# Altium schematic sheet SoM-Interfaces.SchDoc
size A3; DocumentNumber: 1; SheetNumber: 1; SheetTotal: 10; PageSetup: Record=PageOptions|CenterHorizontal=True|CenterVertical=True|PrintScale=0.97|XCorrection=1.00|YCorrection=1.00|PrintKind=1|BorderSize=5000000|LeftOffset=0|BottomOffset=0|Orientation=2|PaperLength=2970|PaperWidth=2100|Scale=100|PaperSource=7|PrintQuality=600|MediaType=1|DitherType=10|PaperKind=A4|PrintScaleMode=1
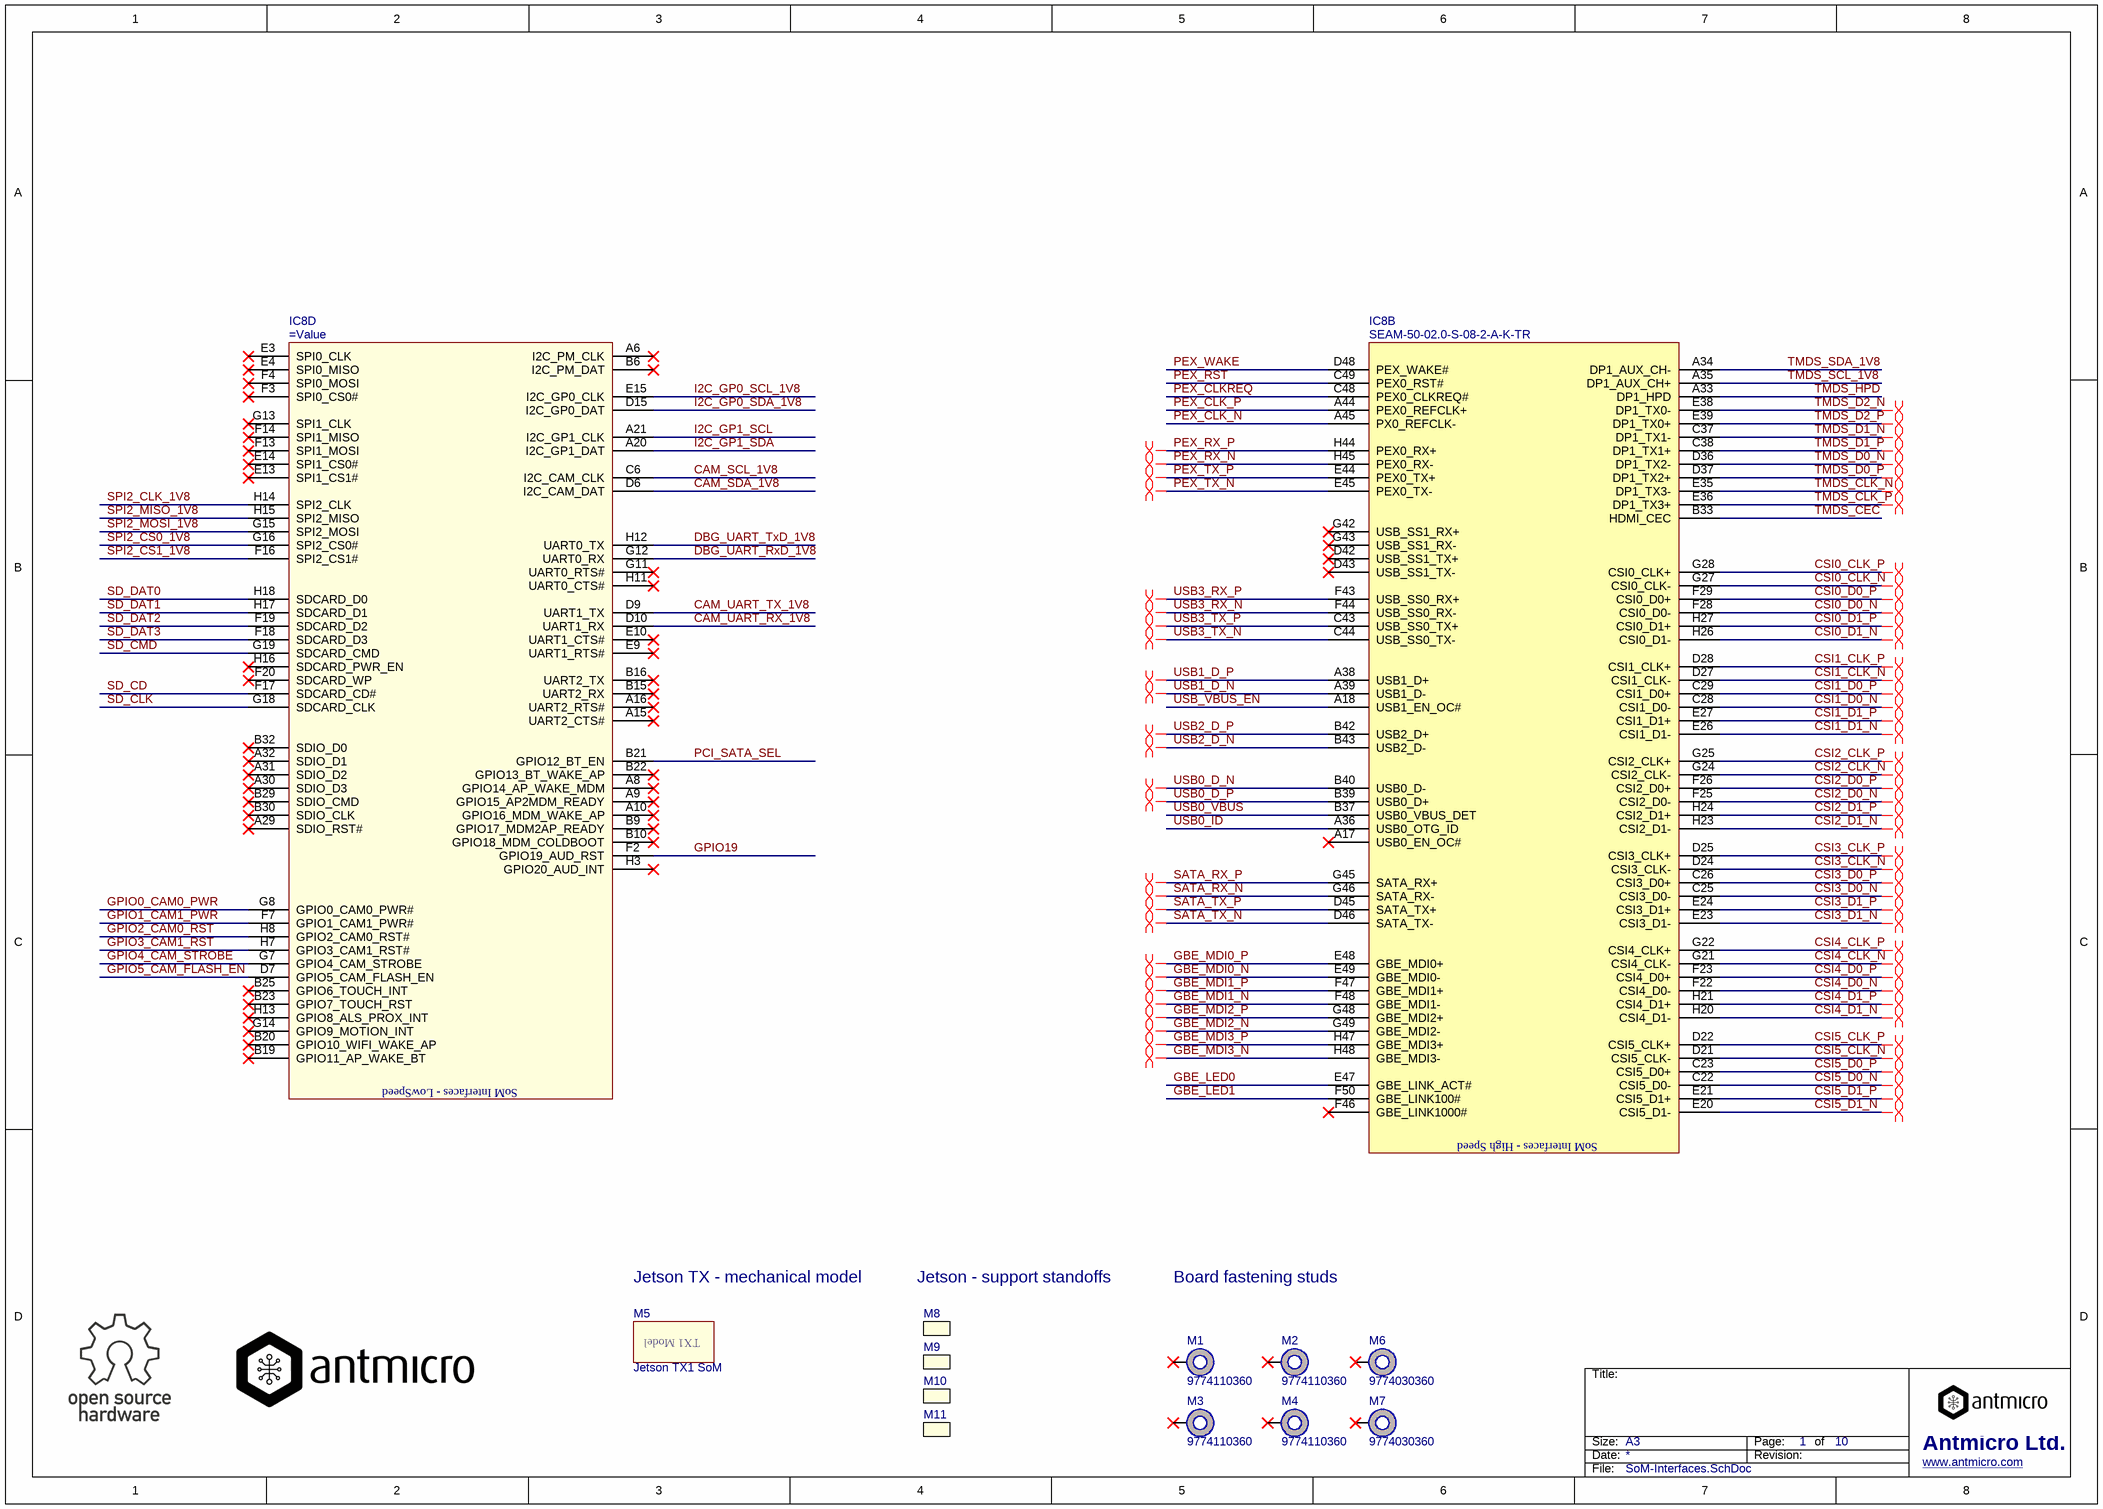
[diagram p0: SoM-Interfaces.SchDoc]

## Parts
IC8  SEAM-50-02.0-S-08-2-A-K-TR  [Nvidia-TX1-SoM]  (parts B,D of 4)
M1  9774110360  [WE_9774110360]
M2  9774110360  [WE_9774110360]
M3  9774110360  [WE_9774110360]
M4  9774110360  [WE_9774110360]
M5  Jetson TX1 SoM  [Nvidia-TX1-Model]
M6  9774030360  [M3-3mm]
M7  9774030360  [M3-3mm]
M8  GENERIC_BOM_ONLY  (value not drawn)  (mechanical)
M9  GENERIC_BOM_ONLY  (value not drawn)  (mechanical)
M10  GENERIC_BOM_ONLY  (value not drawn)  (mechanical)
M11  GENERIC_BOM_ONLY  (value not drawn)  (mechanical)

## Nets
CAM_SCL_1V8: IC8.C6(I2C_CAM_CLK)
CAM_SDA_1V8: IC8.D6(I2C_CAM_DAT)
CAM_UART_RX_1V8: IC8.D10(UART1_RX)
CAM_UART_TX_1V8: IC8.D9(UART1_TX)
CSI0_CLK_N: IC8.G27(CSI0_CLK-)
CSI0_CLK_P: IC8.G28(CSI0_CLK+)
CSI0_D0_N: IC8.F28(CSI0_D0-)
CSI0_D0_P: IC8.F29(CSI0_D0+)
CSI0_D1_N: IC8.H26(CSI0_D1-)
CSI0_D1_P: IC8.H27(CSI0_D1+)
CSI1_CLK_N: IC8.D27(CSI1_CLK-)
CSI1_CLK_P: IC8.D28(CSI1_CLK+)
CSI1_D0_N: IC8.C28(CSI1_D0-)
CSI1_D0_P: IC8.C29(CSI1_D0+)
CSI1_D1_N: IC8.E26(CSI1_D1-)
CSI1_D1_P: IC8.E27(CSI1_D1+)
CSI2_CLK_N: IC8.G24(CSI2_CLK-)
CSI2_CLK_P: IC8.G25(CSI2_CLK+)
CSI2_D0_N: IC8.F25(CSI2_D0-)
CSI2_D0_P: IC8.F26(CSI2_D0+)
CSI2_D1_N: IC8.H23(CSI2_D1-)
CSI2_D1_P: IC8.H24(CSI2_D1+)
CSI3_CLK_N: IC8.D24(CSI3_CLK-)
CSI3_CLK_P: IC8.D25(CSI3_CLK+)
CSI3_D0_N: IC8.C25(CSI3_D0-)
CSI3_D0_P: IC8.C26(CSI3_D0+)
CSI3_D1_N: IC8.E23(CSI3_D1-)
CSI3_D1_P: IC8.E24(CSI3_D1+)
CSI4_CLK_N: IC8.G21(CSI4_CLK-)
CSI4_CLK_P: IC8.G22(CSI4_CLK+)
CSI4_D0_N: IC8.F22(CSI4_D0-)
CSI4_D0_P: IC8.F23(CSI4_D0+)
CSI4_D1_N: IC8.H20(CSI4_D1-)
CSI4_D1_P: IC8.H21(CSI4_D1+)
CSI5_CLK_N: IC8.D21(CSI5_CLK-)
CSI5_CLK_P: IC8.D22(CSI5_CLK+)
CSI5_D0_N: IC8.C22(CSI5_D0-)
CSI5_D0_P: IC8.C23(CSI5_D0+)
CSI5_D1_N: IC8.E20(CSI5_D1-)
CSI5_D1_P: IC8.E21(CSI5_D1+)
DBG_UART_RxD_1V8: IC8.G12(UART0_RX)
DBG_UART_TxD_1V8: IC8.H12(UART0_TX)
GBE_LED0: IC8.E47(GBE_LINK_ACT#)
GBE_LED1: IC8.F50(GBE_LINK100#)
GBE_MDI0_N: IC8.E49(GBE_MDI0-)
GBE_MDI0_P: IC8.E48(GBE_MDI0+)
GBE_MDI1_N: IC8.F48(GBE_MDI1-)
GBE_MDI1_P: IC8.F47(GBE_MDI1+)
GBE_MDI2_N: IC8.G49(GBE_MDI2-)
GBE_MDI2_P: IC8.G48(GBE_MDI2+)
GBE_MDI3_N: IC8.H48(GBE_MDI3-)
GBE_MDI3_P: IC8.H47(GBE_MDI3+)
GPIO0_CAM0_PWR: IC8.G8(GPIO0_CAM0_PWR#)
GPIO1_CAM1_PWR: IC8.F7(GPIO1_CAM1_PWR#)
GPIO2_CAM0_RST: IC8.H8(GPIO2_CAM0_RST#)
GPIO3_CAM1_RST: IC8.H7(GPIO3_CAM1_RST#)
GPIO4_CAM_STROBE: IC8.G7(GPIO4_CAM_STROBE)
GPIO5_CAM_FLASH_EN: IC8.D7(GPIO5_CAM_FLASH_EN)
GPIO19: IC8.F2(GPIO19_AUD_RST)
I2C_GP0_SCL_1V8: IC8.E15(I2C_GP0_CLK)
I2C_GP0_SDA_1V8: IC8.D15(I2C_GP0_DAT)
I2C_GP1_SCL: IC8.A21(I2C_GP1_CLK)
I2C_GP1_SDA: IC8.A20(I2C_GP1_DAT)
PCI_SATA_SEL: IC8.B21(GPIO12_BT_EN)
PEX_CLK_N: IC8.A45(PX0_REFCLK-)
PEX_CLK_P: IC8.A44(PEX0_REFCLK+)
PEX_CLKREQ: IC8.C48(PEX0_CLKREQ#)
PEX_RST: IC8.C49(PEX0_RST#)
PEX_RX_N: IC8.H45(PEX0_RX-)
PEX_RX_P: IC8.H44(PEX0_RX+)
PEX_TX_N: IC8.E45(PEX0_TX-)
PEX_TX_P: IC8.E44(PEX0_TX+)
PEX_WAKE: IC8.D48(PEX_WAKE#)
SATA_RX_N: IC8.G46(SATA_RX-)
SATA_RX_P: IC8.G45(SATA_RX+)
SATA_TX_N: IC8.D46(SATA_TX-)
SATA_TX_P: IC8.D45(SATA_TX+)
SD_CD: IC8.F17(SDCARD_CD#)
SD_CLK: IC8.G18(SDCARD_CLK)
SD_CMD: IC8.G19(SDCARD_CMD)
SD_DAT0: IC8.H18(SDCARD_D0)
SD_DAT1: IC8.H17(SDCARD_D1)
SD_DAT2: IC8.F19(SDCARD_D2)
SD_DAT3: IC8.F18(SDCARD_D3)
SPI2_CLK_1V8: IC8.H14(SPI2_CLK)
SPI2_CS0_1V8: IC8.G16(SPI2_CS0#)
SPI2_CS1_1V8: IC8.F16(SPI2_CS1#)
SPI2_MISO_1V8: IC8.H15(SPI2_MISO)
SPI2_MOSI_1V8: IC8.G15(SPI2_MOSI)
TMDS_CEC: IC8.B33(HDMI_CEC)
TMDS_CLK_N: IC8.E35(DP1_TX3-)
TMDS_CLK_P: IC8.E36(DP1_TX3+)
TMDS_D0_N: IC8.D36(DP1_TX2-)
TMDS_D0_P: IC8.D37(DP1_TX2+)
TMDS_D1_N: IC8.C37(DP1_TX1-)
TMDS_D1_P: IC8.C38(DP1_TX1+)
TMDS_D2_N: IC8.E38(DP1_TX0-)
TMDS_D2_P: IC8.E39(DP1_TX0+)
TMDS_HPD: IC8.A33(DP1_HPD)
TMDS_SCL_1V8: IC8.A35(DP1_AUX_CH+)
TMDS_SDA_1V8: IC8.A34(DP1_AUX_CH-)
USB0_D_N: IC8.B40(USB0_D-)
USB0_D_P: IC8.B39(USB0_D+)
USB0_ID: IC8.A36(USB0_OTG_ID)
USB0_VBUS: IC8.B37(USB0_VBUS_DET)
USB1_D_N: IC8.A39(USB1_D-)
USB1_D_P: IC8.A38(USB1_D+)
USB2_D_N: IC8.B43(USB2_D-)
USB2_D_P: IC8.B42(USB2_D+)
USB3_RX_N: IC8.F44(USB_SS0_RX-)
USB3_RX_P: IC8.F43(USB_SS0_RX+)
USB3_TX_N: IC8.C44(USB_SS0_TX-)
USB3_TX_P: IC8.C43(USB_SS0_TX+)
USB_VBUS_EN: IC8.A18(USB1_EN_OC#)

Not connected (* = marked no-connect by the designer): IC8 A6(I2C_PM_CLK)* A8(GPIO14_AP_WAKE_MDM)* A9(GPIO15_AP2MDM_READY)* A10(GPIO16_MDM_WAKE_AP)* A15(UART2_CTS#)* A16(UART2_RTS#)* A17(USB0_EN_OC#)* A29(SDIO_RST#)* A30(SDIO_D3)* A31(SDIO_D2)* A32(SDIO_D1)* B6(I2C_PM_DAT)* B9(GPIO17_MDM2AP_READY)* B10(GPIO18_MDM_COLDBOOT)* B15(UART2_RX)* B16(UART2_TX)* B19(GPIO11_AP_WAKE_BT)* B20(GPIO10_WIFI_WAKE_AP)* B22(GPIO13_BT_WAKE_AP)* B23(GPIO7_TOUCH_RST)* B25(GPIO6_TOUCH_INT)* B29(SDIO_CMD)* B30(SDIO_CLK)* B32(SDIO_D0)* D42(USB_SS1_TX+)* D43(USB_SS1_TX-)* E3(SPI0_CLK)* E4(SPI0_MISO)* E9(UART1_RTS#)* E10(UART1_CTS#)* E13(SPI1_CS1#)* E14(SPI1_CS0#)* F3(SPI0_CS0#)* F4(SPI0_MOSI)* F13(SPI1_MOSI)* F14(SPI1_MISO)* F20(SDCARD_WP)* F46(GBE_LINK1000#)* G11(UART0_RTS#)* G13(SPI1_CLK)* G14(GPIO9_MOTION_INT)* G42(USB_SS1_RX+)* G43(USB_SS1_RX-)* H3(GPIO20_AUD_INT)* H11(UART0_CTS#)* H13(GPIO8_ALS_PROX_INT)* H16(SDCARD_PWR_EN)*; M1 1*; M2 1*; M3 1*; M4 1*; M6 1*; M7 1*

## Layout directives
differential pair: CSI0_CLK_N, CSI0_CLK_P, CSI0_D0_N, CSI0_D0_P, CSI0_D1_N, CSI0_D1_P, CSI1_CLK_N, CSI1_CLK_P, CSI1_D0_N, CSI1_D0_P, CSI1_D1_N, CSI1_D1_P, CSI2_CLK_N, CSI2_CLK_P, CSI2_D0_N, CSI2_D0_P, CSI2_D1_N, CSI2_D1_P, CSI3_CLK_N, CSI3_CLK_P, CSI3_D0_N, CSI3_D0_P, CSI3_D1_N, CSI3_D1_P, CSI4_CLK_N, CSI4_CLK_P, CSI4_D0_N, CSI4_D0_P, CSI4_D1_N, CSI4_D1_P, CSI5_CLK_N, CSI5_CLK_P, CSI5_D0_N, CSI5_D0_P, CSI5_D1_N, CSI5_D1_P, GBE_MDI0_N, GBE_MDI0_P, GBE_MDI1_N, GBE_MDI1_P, GBE_MDI2_N, GBE_MDI2_P, GBE_MDI3_N, GBE_MDI3_P, PEX_RX_N, PEX_RX_P, PEX_TX_N, PEX_TX_P, SATA_RX_N, SATA_RX_P, SATA_TX_N, SATA_TX_P, TMDS_CLK_N, TMDS_CLK_P, TMDS_D0_N, TMDS_D0_P, TMDS_D1_N, TMDS_D1_P, TMDS_D2_N, TMDS_D2_P, USB0_D_N, USB0_D_P, USB1_D_N, USB1_D_P, USB2_D_N, USB2_D_P, USB3_RX_N, USB3_RX_P, USB3_TX_N, USB3_TX_P

## Notes on the sheet
- (near M5) Jetson TX - mechanical model
- (near M8) Jetson - support standoffs
- Board fastening studs
- Title:
- Size:
- Date:
- A3
- Revision:
- Page:
- of
- Antmicro Ltd.
- File:
- www.antmicro.com
- (in symbol Nvidia-TX1-Model) TX1 Model
- (in symbol Nvidia-TX1-SoM, part B) SoM Interfaces - High Speed
- (in symbol Nvidia-TX1-SoM, part D) SoM Interfaces - LowSpeed

## Library data of the parts
IC8 = Nvidia-TX1-SoM: TX1 module (board connector); Manufacturer: Samtec; Part Number: Nvidia-TX1-SoM; Part Symbol: SEAM-50-02.0-S-08-2-A-K-TR; Value: SEAM-50-02.0-S-08-2-A-K-TR
M1-M4 = WE_9774110360: M3x11.6; Manufacturer: WURTH ELEKTRONIK; Part Number: WE_9774110360; Value: 9774110360; Part Symbol: 9774110360
M5 = Nvidia-TX1-Model: TX1 module; Manufacturer: NVIDIA; Part Symbol: Jetson TX1-SoM; Part Number: Nvidia-TX1-Model; Value: Jetson TX1 SoM
M6 M7 = WE_9774030360: M3x3; Manufacturer: WURTH ELEKTRONIK; Part Number: WE_9774030360; Value: 9774030360; Part Symbol: 9774030360
M8-M11 = GENERIC_BOM_ONLY: Manufacturer: Dremec; Part Symbol: 316/3.2x07